# Altium schematic sheet [02] - Notes.SchDoc
size A4
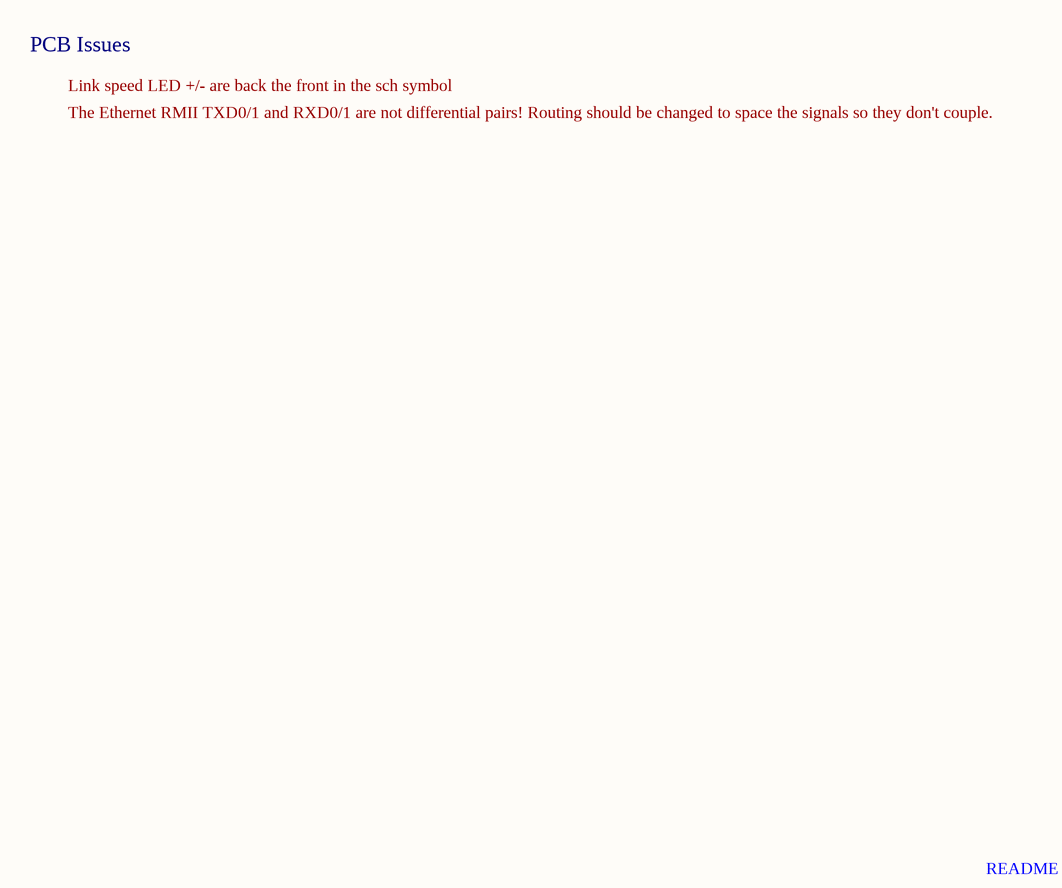
[diagram p0: [02] - Notes.SchDoc]

## Notes on the sheet
- PCB Issues
- Link speed LED +/- are back the front in the sch symbol
- The Ethernet RMII TXD0/1 and RXD0/1 are not differential pairs! Routing should be changed to space the signals so they don't couple.
- README